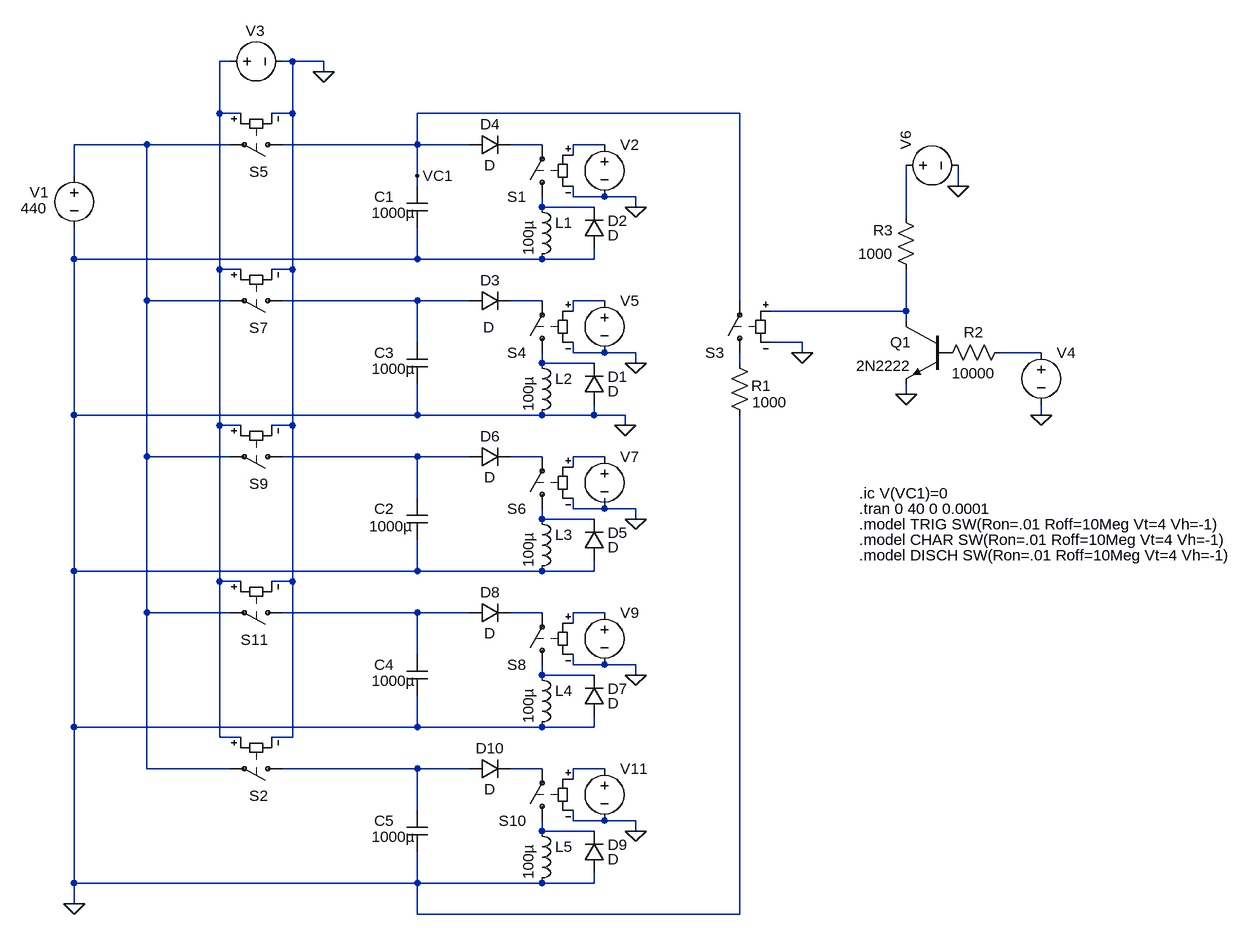
[diagram p0: schematic boostConverterCoilGun.asc]
boostConverterCoilGun.asc, the LTspice schematic file:
Version 4
SHEET 1 3300 1328
WIRE -16 -32 -32 -32
WIRE 80 -32 64 -32
WIRE 128 -32 80 -32
WIRE 128 -16 128 -32
WIRE -32 48 -32 -32
WIRE 0 48 -32 48
WIRE 80 48 80 -32
WIRE 80 48 48 48
WIRE 768 48 272 48
WIRE -144 96 -256 96
WIRE -16 96 -144 96
WIRE 272 96 272 48
WIRE 272 96 64 96
WIRE 352 96 272 96
WIRE 464 96 416 96
WIRE 560 96 512 96
WIRE 512 112 512 96
WIRE -256 144 -256 96
WIRE 272 144 272 96
WIRE 272 160 272 144
WIRE 1104 160 1104 128
WIRE 512 176 512 160
WIRE 560 176 512 176
WIRE 608 176 560 176
WIRE 464 192 464 176
WIRE 544 192 464 192
WIRE 608 192 608 176
WIRE 1024 208 1024 128
WIRE -256 272 -256 224
WIRE 272 272 272 224
WIRE 272 272 -256 272
WIRE 464 272 272 272
WIRE 544 272 544 256
WIRE 544 272 464 272
WIRE -32 288 -32 48
WIRE 0 288 -32 288
WIRE 80 288 80 48
WIRE 80 288 48 288
WIRE -144 336 -144 96
WIRE -16 336 -144 336
WIRE 272 336 64 336
WIRE 352 336 272 336
WIRE 464 336 416 336
WIRE 560 336 512 336
WIRE 768 336 768 48
WIRE 512 352 512 336
WIRE 1024 352 1024 288
WIRE 1024 352 816 352
WIRE 1024 368 1024 352
WIRE 272 400 272 336
WIRE 864 400 816 400
WIRE 512 416 512 400
WIRE 560 416 512 416
WIRE 608 416 560 416
WIRE 864 416 864 400
WIRE 1232 416 1168 416
WIRE 464 432 464 416
WIRE 544 432 464 432
WIRE 608 432 608 416
WIRE 768 432 768 416
WIRE 1024 480 1024 464
WIRE -256 512 -256 272
WIRE 272 512 272 464
WIRE 272 512 -256 512
WIRE 464 512 272 512
WIRE 544 512 544 496
WIRE 544 512 464 512
WIRE 592 512 544 512
WIRE 1232 512 1232 496
WIRE -32 528 -32 288
WIRE 0 528 -32 528
WIRE 80 528 80 288
WIRE 80 528 48 528
WIRE 592 528 592 512
WIRE -144 576 -144 336
WIRE -16 576 -144 576
WIRE 272 576 64 576
WIRE 352 576 272 576
WIRE 464 576 416 576
WIRE 560 576 512 576
WIRE 512 592 512 576
WIRE 272 640 272 576
WIRE 512 656 512 640
WIRE 560 656 560 640
WIRE 560 656 512 656
WIRE 608 656 560 656
WIRE 464 672 464 656
WIRE 544 672 464 672
WIRE 608 672 608 656
WIRE -256 752 -256 512
WIRE 272 752 272 704
WIRE 272 752 -256 752
WIRE 464 752 272 752
WIRE 544 752 544 736
WIRE 544 752 464 752
WIRE -32 768 -32 528
WIRE 0 768 -32 768
WIRE 80 768 80 528
WIRE 80 768 48 768
WIRE -144 816 -144 576
WIRE -16 816 -144 816
WIRE 272 816 64 816
WIRE 352 816 272 816
WIRE 464 816 416 816
WIRE 560 816 512 816
WIRE 512 832 512 816
WIRE 272 880 272 816
WIRE 512 896 512 880
WIRE 560 896 512 896
WIRE 608 896 560 896
WIRE 464 912 464 896
WIRE 544 912 464 912
WIRE 608 912 608 896
WIRE -256 992 -256 752
WIRE 272 992 272 944
WIRE 272 992 -256 992
WIRE 464 992 272 992
WIRE 544 992 544 976
WIRE 544 992 464 992
WIRE -32 1008 -32 768
WIRE 0 1008 -32 1008
WIRE 80 1008 80 768
WIRE 80 1008 48 1008
WIRE -144 1056 -144 816
WIRE -16 1056 -144 1056
WIRE 272 1056 64 1056
WIRE 352 1056 272 1056
WIRE 464 1056 416 1056
WIRE 560 1056 512 1056
WIRE 512 1072 512 1056
WIRE 272 1120 272 1056
WIRE 512 1136 512 1120
WIRE 560 1136 512 1136
WIRE 608 1136 560 1136
WIRE 464 1152 464 1136
WIRE 544 1152 464 1152
WIRE 608 1152 608 1136
WIRE -256 1232 -256 992
WIRE 272 1232 272 1184
WIRE 272 1232 -256 1232
WIRE 464 1232 272 1232
WIRE 544 1232 544 1216
WIRE 544 1232 464 1232
WIRE -256 1264 -256 1232
WIRE 272 1280 272 1232
WIRE 768 1280 768 512
WIRE 768 1280 272 1280
FLAG 272 144 VC1
FLAG -256 1264 0
FLAG 1232 512 0
FLAG 1024 480 0
FLAG 1104 160 0
FLAG 608 432 0
FLAG 592 528 0
FLAG 608 672 0
FLAG 608 912 0
FLAG 608 1152 0
FLAG 608 192 0
FLAG 128 -16 0
FLAG 864 416 0
SYMBOL cap 256 160 R0
WINDOW 0 -50 16 Left 2
WINDOW 3 -54 41 Left 2
SYMATTR InstName C1
SYMATTR Value 1000µ
SYMATTR SpiceLine V=450 Rser=0.25
SYMBOL ind 448 176 R0
WINDOW 3 -5 90 VLeft 2
SYMATTR Value 100µ
SYMATTR InstName L1
SYMATTR SpiceLine Rser=0.09
SYMBOL sw 464 192 R180
SYMATTR InstName S1
SYMATTR Value ""
SYMATTR SpiceModel TRIG
SYMBOL voltage 560 80 R0
WINDOW 3 24 96 Invisible 2
WINDOW 123 0 0 Left 0
WINDOW 39 0 0 Left 0
SYMATTR Value PULSE(0 5 3 0.00000000000000000000000000001 0.00000000000000000000000000001 1 6 4)
SYMATTR InstName V2
SYMBOL voltage -32 -32 R270
WINDOW 3 24 96 Invisible 2
WINDOW 123 0 0 Left 0
WINDOW 39 0 0 Left 0
WINDOW 0 47 40 VRight 2
SYMATTR Value PULSE(0 5 2 0.0000000000001 0.0000000000001 0.8 6 5)
SYMATTR InstName V3
SYMBOL diode 560 256 R180
WINDOW 0 -36 43 Left 2
WINDOW 3 -22 21 Left 2
SYMATTR InstName D2
SYMBOL voltage -256 128 R0
WINDOW 0 -68 41 Left 2
WINDOW 3 -82 66 Left 2
WINDOW 123 0 0 Left 0
SYMATTR InstName V1
SYMATTR Value 440
SYMATTR SpiceLine Rser=0.1
SYMBOL res 752 416 R0
WINDOW 3 35 76 Left 2
WINDOW 0 34 51 Left 2
SYMATTR Value 1000
SYMATTR InstName R1
SYMATTR SpiceLine tol=5
SYMBOL diode 352 112 R270
WINDOW 0 32 32 VTop 2
WINDOW 3 0 32 VBottom 2
SYMATTR InstName D4
SYMBOL sw 464 432 R180
SYMATTR InstName S4
SYMATTR Value ""
SYMATTR SpiceModel TRIG
SYMBOL voltage 560 320 R0
WINDOW 3 24 96 Invisible 2
WINDOW 123 0 0 Left 0
WINDOW 39 0 0 Left 0
SYMATTR Value PULSE(0 5 3.1 0.00000000000000000000000000001 0.00000000000000000000000000001 1 6 4)
SYMATTR InstName V5
SYMBOL diode 560 496 R180
WINDOW 0 -36 43 Left 2
WINDOW 3 -22 21 Left 2
SYMATTR InstName D1
SYMBOL diode 352 352 R270
WINDOW 0 32 32 VTop 2
WINDOW 3 -9 30 VBottom 2
SYMATTR InstName D3
SYMBOL sw 464 672 R180
SYMATTR InstName S6
SYMATTR Value ""
SYMATTR SpiceModel TRIG
SYMBOL voltage 560 560 R0
WINDOW 3 24 96 Invisible 2
WINDOW 123 0 0 Left 0
WINDOW 39 0 0 Left 0
SYMATTR Value PULSE(0 5 3.15 0.00000000000000000000000000001 0.00000000000000000000000000001 1 6 4)
SYMATTR InstName V7
SYMBOL diode 560 736 R180
WINDOW 0 -36 43 Left 2
WINDOW 3 -22 21 Left 2
SYMATTR InstName D5
SYMBOL diode 352 592 R270
WINDOW 0 32 32 VTop 2
WINDOW 3 0 32 VBottom 2
SYMATTR InstName D6
SYMBOL cap 256 880 R0
WINDOW 0 -50 16 Left 2
WINDOW 3 -54 41 Left 2
SYMATTR InstName C4
SYMATTR Value 1000µ
SYMATTR SpiceLine V=450 Rser=0.25
SYMBOL sw 464 912 R180
SYMATTR InstName S8
SYMATTR Value ""
SYMATTR SpiceModel TRIG
SYMBOL voltage 560 800 R0
WINDOW 3 24 96 Invisible 2
WINDOW 123 0 0 Left 0
WINDOW 39 0 0 Left 0
SYMATTR Value PULSE(0 5 3.175 0.00000000000000000000000000001 0.00000000000000000000000000001 1 6 4)
SYMATTR InstName V9
SYMBOL diode 560 976 R180
WINDOW 0 -36 43 Left 2
WINDOW 3 -22 21 Left 2
SYMATTR InstName D7
SYMBOL diode 352 832 R270
WINDOW 0 32 32 VTop 2
WINDOW 3 0 32 VBottom 2
SYMATTR InstName D8
SYMBOL sw 464 1152 R180
SYMATTR InstName S10
SYMATTR Value ""
SYMATTR SpiceModel TRIG
SYMBOL voltage 560 1040 R0
WINDOW 3 24 96 Invisible 2
WINDOW 123 0 0 Left 0
WINDOW 39 0 0 Left 0
SYMATTR Value PULSE(0 5 3.1875 0.00000000000000000000000000001 0.00000000000000000000000000001 1 6 4)
SYMATTR InstName V11
SYMBOL diode 560 1216 R180
WINDOW 0 -36 43 Left 2
WINDOW 3 -22 21 Left 2
SYMATTR InstName D9
SYMBOL diode 352 1072 R270
WINDOW 0 32 32 VTop 2
WINDOW 3 0 32 VBottom 2
SYMATTR InstName D10
SYMBOL sw 80 96 R90
WINDOW 0 42 37 VRight 2
SYMATTR InstName S5
SYMATTR Value ""
SYMATTR SpiceModel CHAR
SYMBOL sw 80 336 R90
WINDOW 0 42 37 VRight 2
SYMATTR InstName S7
SYMATTR Value ""
SYMATTR SpiceModel CHAR
SYMBOL sw 80 576 R90
WINDOW 0 42 37 VRight 2
SYMATTR InstName S9
SYMATTR Value ""
SYMATTR SpiceModel CHAR
SYMBOL sw 80 816 R90
WINDOW 0 42 37 VRight 2
SYMATTR InstName S11
SYMATTR Value ""
SYMATTR SpiceModel CHAR
SYMBOL sw 80 1056 R90
WINDOW 0 42 37 VRight 2
SYMATTR InstName S2
SYMATTR Value ""
SYMATTR SpiceModel CHAR
SYMBOL voltage 1232 400 R0
WINDOW 3 24 96 Invisible 2
WINDOW 123 0 0 Left 0
WINDOW 39 0 0 Left 0
SYMATTR Value PULSE(5 0 30 0.001 0.001 10 1 1)
SYMATTR InstName V4
SYMBOL npn 1088 368 M0
SYMATTR InstName Q1
SYMATTR Value 2N2222
SYMBOL res 1184 400 R90
WINDOW 0 0 56 VBottom 2
WINDOW 3 32 56 VTop 2
SYMATTR InstName R2
SYMATTR Value 10000
SYMBOL res 1040 304 R180
WINDOW 0 36 76 Left 2
WINDOW 3 36 40 Left 2
SYMATTR InstName R3
SYMATTR Value 1000
SYMBOL voltage 1008 128 R270
WINDOW 3 24 96 Invisible 2
WINDOW 123 0 0 Left 0
WINDOW 39 0 0 Left 0
SYMATTR Value PULSE(5 0 35 0.001 0.001 10 1 1)
SYMATTR InstName V6
SYMBOL sw 768 432 R180
SYMATTR InstName S3
SYMATTR Value ""
SYMATTR SpiceModel DISCH
SYMBOL cap 256 640 R0
WINDOW 0 -50 16 Left 2
WINDOW 3 -58 43 Left 2
SYMATTR InstName C2
SYMATTR Value 1000µ
SYMATTR SpiceLine V=450 Rser=0.25
SYMBOL cap 256 400 R0
WINDOW 0 -50 16 Left 2
WINDOW 3 -54 41 Left 2
SYMATTR InstName C3
SYMATTR Value 1000µ
SYMATTR SpiceLine V=450 Rser=0.25
SYMBOL cap 256 1120 R0
WINDOW 0 -50 16 Left 2
WINDOW 3 -54 41 Left 2
SYMATTR InstName C5
SYMATTR Value 1000µ
SYMATTR SpiceLine V=450 Rser=0.25
SYMBOL ind 448 416 R0
WINDOW 3 -5 90 VLeft 2
SYMATTR Value 100µ
SYMATTR InstName L2
SYMATTR SpiceLine Rser=0.09
SYMBOL ind 448 656 R0
WINDOW 3 -5 90 VLeft 2
SYMATTR Value 100µ
SYMATTR InstName L3
SYMATTR SpiceLine Rser=0.09
SYMBOL ind 448 896 R0
WINDOW 3 -5 90 VLeft 2
SYMATTR Value 100µ
SYMATTR InstName L4
SYMATTR SpiceLine Rser=0.09
SYMBOL ind 448 1136 R0
WINDOW 3 -5 90 VLeft 2
SYMATTR Value 100µ
SYMATTR InstName L5
SYMATTR SpiceLine Rser=0.09
TEXT 952 632 Left 2 !.ic V(VC1)=0
TEXT 952 656 Left 2 !.tran 0 40 0 0.0001
TEXT 952 680 Left 2 !.model TRIG SW(Ron=.01 Roff=10Meg Vt=4 Vh=-1)
TEXT 952 704 Left 2 !.model CHAR SW(Ron=.01 Roff=10Meg Vt=4 Vh=-1)
TEXT 952 728 Left 2 !.model DISCH SW(Ron=.01 Roff=10Meg Vt=4 Vh=-1)

The netlist it stands for:
* boostConverterCoilGun.asc
C1 VC1 0 1000µ V=450 Rser=0.25
L1 N005 0 100µ Rser=0.09
S1 N005 N003 N004 0 TRIG
V2 N004 0 PULSE(0 5 3 0.00000000000000000000000000001 0.00000000000000000000000000001 1 6 4)
V3 N001 0 PULSE(0 5 2 0.0000000000001 0.0000000000001 0.8 6 5)
D2 0 N005 D
V1 N002 0 440 Rser=0.1
R1 N013 0 1000 tol=5
D4 VC1 N003 D
S4 N012 N008 N009 0 TRIG
V5 N009 0 PULSE(0 5 3.1 0.00000000000000000000000000001 0.00000000000000000000000000001 1 6 4)
D1 0 N012 D
D3 N007 N008 D
S6 N017 N015 N016 0 TRIG
V7 N016 0 PULSE(0 5 3.15 0.00000000000000000000000000001 0.00000000000000000000000000001 1 6 4)
D5 0 N017 D
D6 N014 N015 D
C4 N018 0 1000µ V=450 Rser=0.25
S8 N021 N019 N020 0 TRIG
V9 N020 0 PULSE(0 5 3.175 0.00000000000000000000000000001 0.00000000000000000000000000001 1 6 4)
D7 0 N021 D
D8 N018 N019 D
S10 N025 N023 N024 0 TRIG
V11 N024 0 PULSE(0 5 3.1875 0.00000000000000000000000000001 0.00000000000000000000000000001 1 6 4)
D9 0 N025 D
D10 N022 N023 D
S5 VC1 N002 N001 0 CHAR
S7 N007 N002 N001 0 CHAR
S9 N014 N002 N001 0 CHAR
S11 N018 N002 N001 0 CHAR
S2 N022 N002 N001 0 CHAR
V4 N011 0 PULSE(5 0 30 0.001 0.001 10 1 1)
Q1 N010 P001 0 0 2N2222
R2 N011 P001 10000
R3 N010 N006 1000
V6 N006 0 PULSE(5 0 35 0.001 0.001 10 1 1)
S3 N013 VC1 N010 0 DISCH
C2 N014 0 1000µ V=450 Rser=0.25
C3 N007 0 1000µ V=450 Rser=0.25
C5 N022 0 1000µ V=450 Rser=0.25
L2 N012 0 100µ Rser=0.09
L3 N017 0 100µ Rser=0.09
L4 N021 0 100µ Rser=0.09
L5 N025 0 100µ Rser=0.09
.model D D
.lib standard.dio
.model NPN NPN
.model PNP PNP
.lib standard.bjt
.ic V(VC1)=0
.tran 0 40 0 0.0001
.model TRIG SW(Ron=.01 Roff=10Meg Vt=4 Vh=-1)
.model CHAR SW(Ron=.01 Roff=10Meg Vt=4 Vh=-1)
.model DISCH SW(Ron=.01 Roff=10Meg Vt=4 Vh=-1)
.backanno
.end